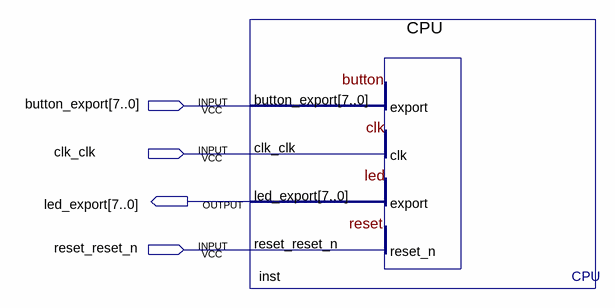
[diagram p0: schematic sheet]
// Quartus schematic JumpGame.bdf as structural Verilog: 1 symbols, 4 pins
module JumpGame (
  input  [7:0] button_export,
  input  clk_clk,
  input  reset_reset_n,
  output [7:0] led_export
);

  CPU inst (.button_export(button_export), .clk_clk(clk_clk), .reset_reset_n(reset_reset_n), .led_export(led_export));
endmodule
